# EAGLE design dmx reciever platine universal (EAGLE 6.4)
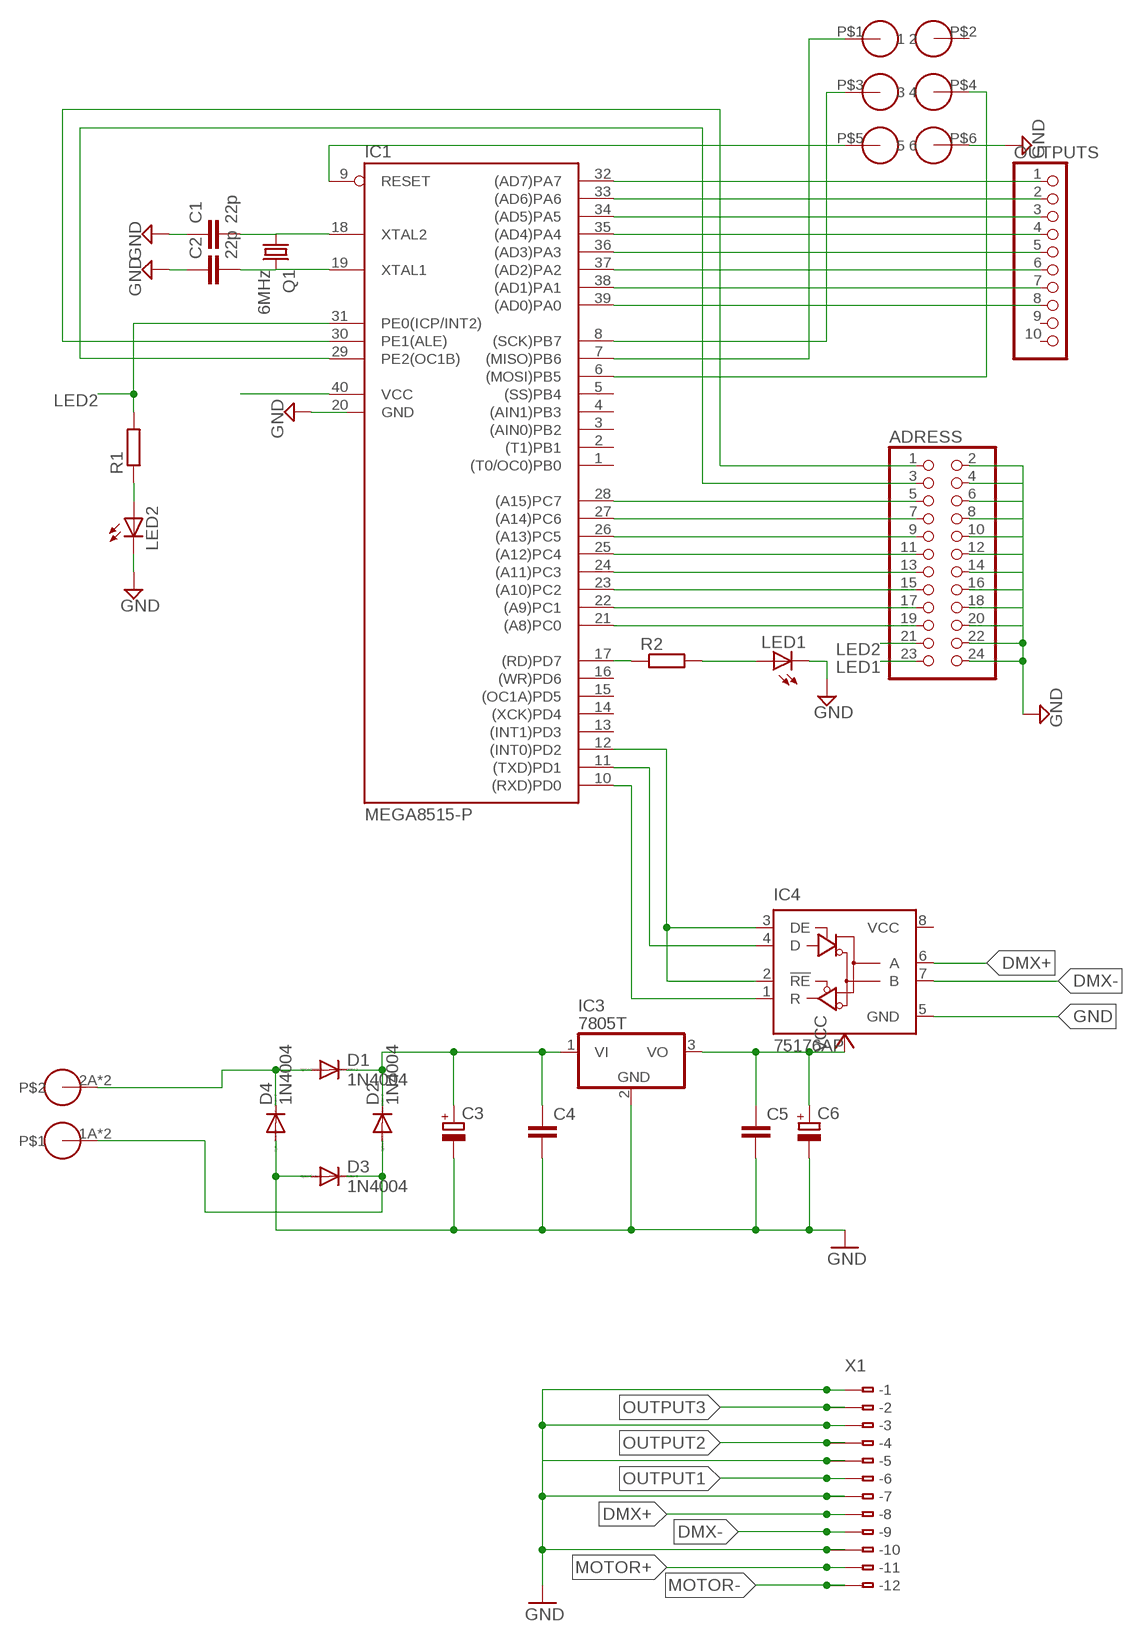
[diagram p0: schematic, sheet 1]

## Parts
ADRESS  PINHD-2X12  [2X12]
C1  22p  C-EU025-024X044  [C025-024X044]
C2  22p  C-EU025-024X044  [C025-024X044]
C3  CPOL-EUE3.5-8  [E3,5-8]
C4  C-EU025-024X044  [C025-024X044]
C5  C-EU025-024X044  [C025-024X044]
C6  CPOL-EUE3.5-8  [E3,5-8]
D1  1N4004  [DO41-10]
D2  1N4004  [DO41-10]
D3  1N4004  [DO41-10]
D4  1N4004  [DO41-10]
IC1  MEGA8515-P  [DIL40]
IC3  7805T  [TO220H]
IC4  75176AP  [DIL08]
ISP  2X3  [2X3]
LED1  LEDCHIP-LED0805  [CHIP-LED0805]
LED2  LEDCHIP-LED0805  [CHIP-LED0805]
OUTPUTS  PINHD-1X10  [1X10]
Q1  6MHz  CRYSTALHC49S  [HC49/S]
R1  R-EU_M0805  [M0805]
R2  R-EU_M0805  [M0805]
U$1  WAGO20602POL  [WAGO20602PIN]
X1  233-112  [233-112]

## Nets
DMX+: IC4.6(A) X1.A8(-8) X1.B8(B-8)
DMX-: IC4.7(B) X1.A9(-9) X1.B9(B-9)
GND: ADRESS.2 ADRESS.4 ADRESS.6 ADRESS.8 ADRESS.10 ADRESS.12 ADRESS.14 ADRESS.16 ADRESS.18 ADRESS.20 ADRESS.22 ADRESS.24 C1.1 C2.1 C3.- C4.2 C5.2 C6.- D3.A D4.A IC3.2(GND) IC4.5(GND) ISP.P$6 LED1.C LED2.C X1.A1(-1) X1.A3(-3) X1.A5(-5) X1.A7(-7) X1.A10(-10) X1.B1(B-1) X1.B3(B-3) X1.B5(B-5) X1.B7(B-7) X1.B10(B-10)
LED1: ADRESS.23 IC1.17((RD)PD7) R2.1
LED2: ADRESS.21 IC1.31(PE0(ICP/INT2)) R1.2
MOTOR+: X1.A11(-11) X1.B11(B-11)
MOTOR-: X1.A12(-12) X1.B12(B-12)
N$1: C2.2 IC1.19(XTAL1) Q1.2
N$2: C1.2 IC1.18(XTAL2) Q1.1
N$3: ADRESS.5 IC1.28((A15)PC7)
N$4: ADRESS.7 IC1.27((A14)PC6)
N$5: ADRESS.15 IC1.23((A10)PC2)
N$6: ADRESS.9 IC1.26((A13)PC5)
N$7: ADRESS.11 IC1.25((A12)PC4)
N$8: ADRESS.13 IC1.24((A11)PC3)
N$9: LED2.A R1.1
N$10: ADRESS.17 IC1.22((A9)PC1)
N$11: ADRESS.3 IC1.29(PE2(OC1B))
N$12: ADRESS.1 IC1.30(PE1(ALE))
N$16: IC1.9(RESET) ISP.P$5
N$17: IC1.8((SCK)PB7) ISP.P$3
N$18: IC1.7((MISO)PB6) ISP.P$1
N$19: IC1.6((MOSI)PB5) ISP.P$4
N$20: IC1.10((RXD)PD0) IC4.1(R)
N$21: IC1.12((INT0)PD2) IC4.2(!RE) IC4.3(DE)
N$22: IC1.11((TXD)PD1) IC4.4(D)
N$23: ADRESS.19 IC1.21((A8)PC0)
N$37: LED1.A R2.2
N$38: D1.A D4.C U$1.2A U$1.2B
N$40: D2.A D3.C U$1.1A U$1.1B
N$42: C3.+ C4.1 D1.C D2.C IC3.1(VI)
OUTPUT1: IC1.32((AD7)PA7) OUTPUTS.1 X1.A6(-6) X1.B6(B-6)
OUTPUT2: IC1.33((AD6)PA6) OUTPUTS.2 X1.A4(-4) X1.B4(B-4)
OUTPUT3: IC1.34((AD5)PA5) OUTPUTS.3 X1.A2(-2) X1.B2(B-2)
OUTPUT4: IC1.35((AD4)PA4) OUTPUTS.4
OUTPUT5: IC1.36((AD3)PA3) OUTPUTS.5
OUTPUT6: IC1.37((AD2)PA2) OUTPUTS.6
OUTPUT7: IC1.38((AD1)PA1) OUTPUTS.7
OUTPUT8: IC1.39((AD0)PA0) OUTPUTS.8
VCC: C5.1 C6.+ IC1.40(VCC) IC3.3(VO)
Unconnected: IC1.1((T0/OC0)PB0) IC1.2((T1)PB1) IC1.3((AIN0)PB2) IC1.4((AIN1)PB3) IC1.5((SS)PB4) IC1.13((INT1)PD3) IC1.14((XCK)PD4) IC1.15((OC1A)PD5) IC1.16((WR)PD6) ISP.P$2 OUTPUTS.9 OUTPUTS.10

## Power pins joined to a net without a drawn wire
GND: IC1.20(GND)
VCC: IC4.8(VCC)

## Library data of the parts
ADRESS = pinhead:PINHD-2X12: PIN HEADER
C1 C2 C4 C5 = rcl:C-EU: CAPACITOR, European symbol
C3 C6 = rcl:CPOL-EU: POLARIZED CAPACITOR, European symbol
D1-D4 = diode:1N4004: DIODE general purpose rectifier, 1 A
IC1 = atmel:MEGA8515-P: MICROCONTROLLER 8 Kbytes FLASH 512 bytes SRAM 512 bytes EEPROM USART 8-channel 10 bit ADC Source: avr.lbr; MPN: ATMEGA8515-16PU; OC_FARNELL: 9171401; OC_NEWARK: 01M6905
IC3 = linear:78*: Positive VOLTAGE REGULATOR Source: http://cache.national.com/ds/LM/LM78L05.pdf http://www.fairchildsemi.com/ds/LM/LM7805.pdf
IC4 = 751xx:75176A: DIFFERENTIAL BUS TRANSCEIVER Source: http://focus.ti.com/lit/ds/symlink/sn75176a.pdf
ISP = stiftleisten:2X3
LED1 LED2 = led:LED: LED OSRAM: - CHIPLED LG R971, LG N971, LY N971, LG Q971, LY Q971, LO R971, LY R971 LH N974, LH R974 LS Q976, LO Q976, LY Q976 LO Q996 - Hyper CHIPLED LW Q18S LB Q993, LB Q99A, LB R99A - SideLED LS A670, LO A670, LY A670, LG A670, LP A670 LB A673, LV A673, LT A673, LW A673 LH A674 LY A675 LS A676, LA A676, LO A676, LY A676, LW A676 LS A679, LY A679, LG A679 - Hyper Micro SIDELED® LS Y876, LA Y876, LO Y876, LY Y876 LT Y87S - SmartLED LW L88C, LW L88S LB L89C, LB L89S, LG L890 LS L89K, LO L89K, LY L89K LS L896, LA L896, LO L896, LY L896 - TOPLED LS T670, LO T670, LY T670, LG T670, LP T670 LSG T670, LSP T670, LSY T670, LOP T670, LYG T670 LG T671, LOG T671, LSG T671 LB T673, LV T673, LT T673, LW T673 LH T674 LS T676, LA T676, LO T676, LY T676, LB T676, LH T676, LSB T676, LW T676 LB T67C, LV T67C, LT T67C, LS T67K, LO T67K, LY T67K, LW E67C LS E67B, LA E67B, LO E67B, LY E67B, LB E67C, LV E67C, LT E67C LW T67C LS T679, LY T679, LG T679 LS T770, LO T770, LY T770, LG T770, LP T770 LB T773, LV T773, LT T773, LW T773 LH T774 LS E675, LA E675, LY E675, LS T675 LS T776, LA T776, LO T776, LY T776, LB T776 LHGB T686 LT T68C, LB T68C - Hyper Mini TOPLED® LB M676 - Mini TOPLED Santana® LG M470 LS M47K, LO M47K, LY M47K Source: http://www.osram.convergy.de LUXEON: - LUMILED® LXK2-PW12-R00, LXK2-PW12-S00, LXK2-PW14-U00, LXK2-PW14-V00 LXK2-PM12-R00, LXK2-PM12-S00, LXK2-PM14-U00 LXK2-PE12-Q00, LXK2-PE12-R00, LXK2-PE12-S00, LXK2-PE14-T00, LXK2-PE14-U00 LXK2-PB12-K00, LXK2-PB12-L00, LXK2-PB12-M00, LXK2-PB14-N00, LXK2-PB14-P00, LXK2-PB14-Q00 LXK2-PR12-L00, LXK2-PR12-M00, LXK2-PR14-Q00, LXK2-PR14-R00 LXK2-PD12-Q00, LXK2-PD12-R00, LXK2-PD12-S00 LXK2-PH12-R00, LXK2-PH12-S00 LXK2-PL12-P00, LXK2-PL12-Q00, LXK2-PL12-R00 Source: www.luxeon.com KINGBRIGHT: KA-3528ASYC Source: www.kingbright.com
OUTPUTS = pinhead:PINHD-1X10: PIN HEADER
Q1 = crystal:CRYSTAL: CRYSTAL; OC_FARNELL: 1667008; OC_NEWARK: unknown
R1 R2 = rcl:R-EU_: RESISTOR, European symbol
U$1 = blafoo:WAGO20602POL
X1 = con-wago:233-112: WAGO Cage Clamp; MPN: 233-112; OC_FARNELL: unknown; OC_NEWARK: 28K9053

## Board
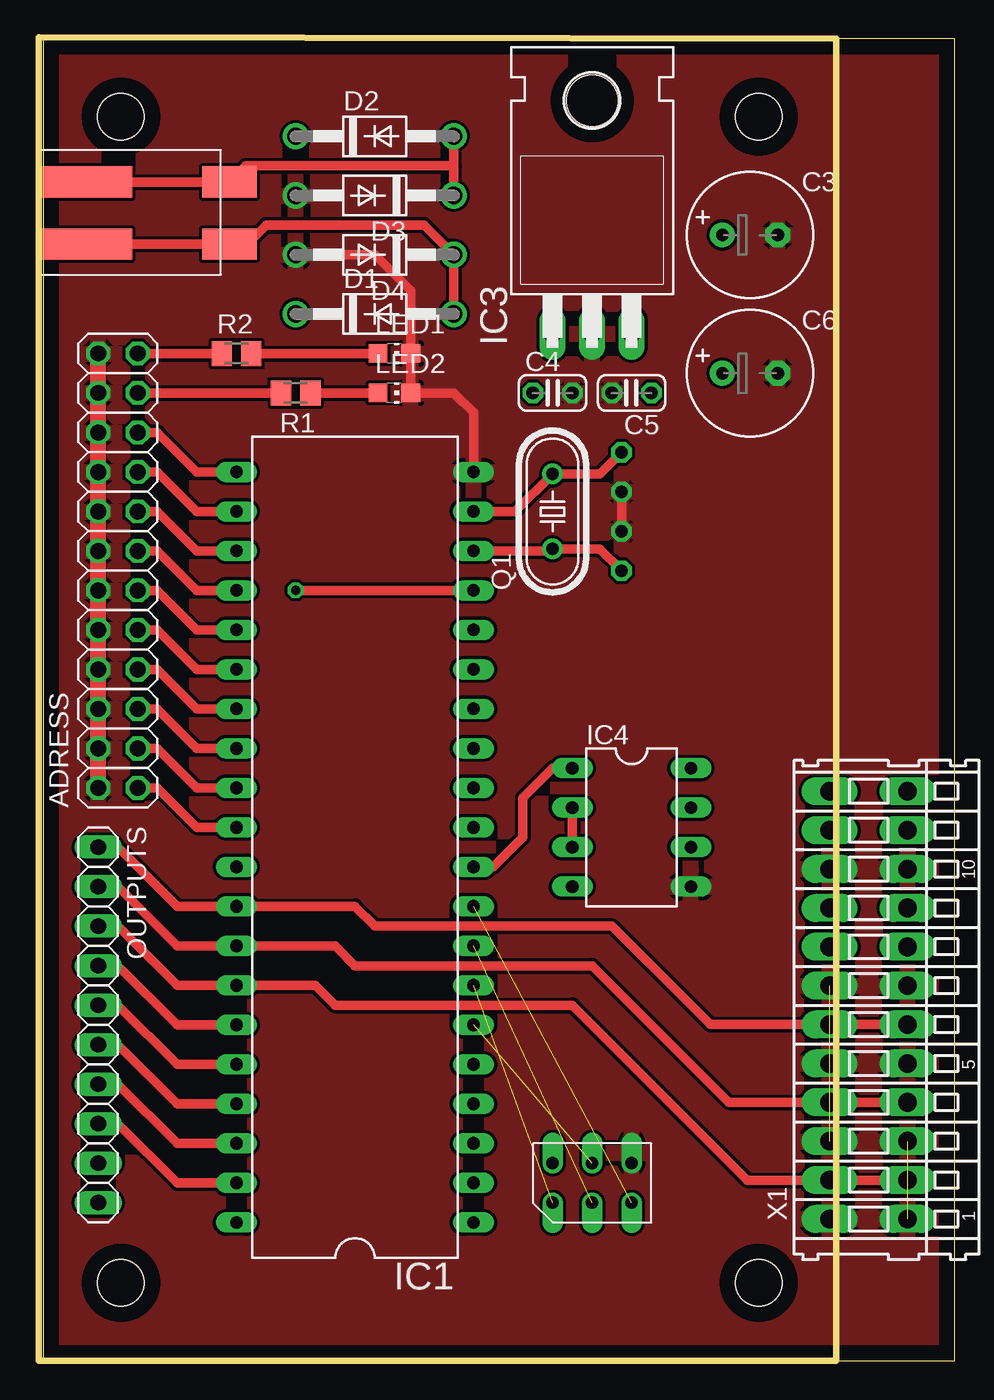
[diagram p1: board, top side]
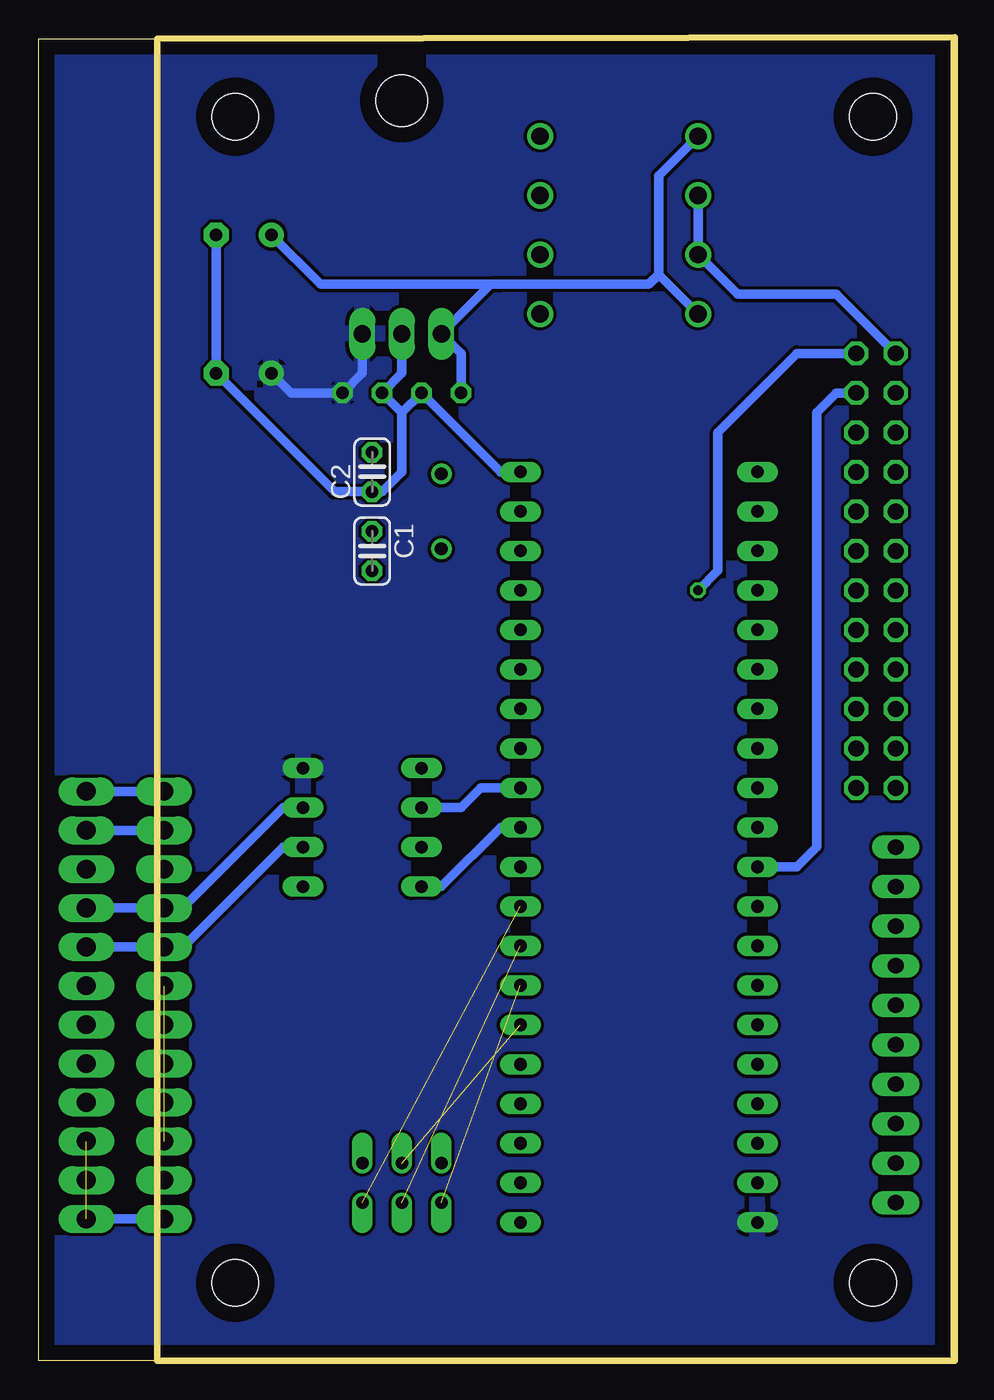
[diagram p2: board, bottom side, seen from below]

Size 58.62 x 85 mm. Coordinates in mm from the lower left corner, seen from the top.
Outline: 0,0 58.62,0 58.62,85 0,85 0,0
Copper layers (1*16): Top 0.035mm / dielectric 1.5mm / Bottom 0.035mm
Design rules "default": minimum track width 10mil, minimum drill 24mil, track to track 8mil, track to pad 8mil, pad to pad 8mil, via to via 8mil, smd to smd 8mil, copper to edge 40mil, drill to drill 8mil, minimum pad ring 10mil, minimum via ring 8mil, stop-mask expansion 4mil, vias tented up to drill 0mil, thermal gap 10mil
Holes 3 mm at 5,80 46,80 46,5 5,5
Milling: 4 lines

### Footprints (pad centres in the part's own frame; a part is rotated, then mirrored left to right if it is on the bottom)
2X12 = drill 1.016 octagon: 1 -13.97,-1.27; 2 -13.97,1.27; 3 -11.43,-1.27; 4 -11.43,1.27; 5 -8.89,-1.27; 6 -8.89,1.27; 7 -6.35,-1.27; 8 -6.35,1.27; 9 -3.81,-1.27; 10 -3.81,1.27; 11 -1.27,-1.27; 12 -1.27,1.27; 13 1.27,-1.27; 14 1.27,1.27; 15 3.81,-1.27; 16 3.81,1.27; 17 6.35,-1.27; 18 6.35,1.27; 19 8.89,-1.27; 20 8.89,1.27; 21 11.43,-1.27; 22 11.43,1.27; 23 13.97,-1.27; 24 13.97,1.27
C025-024X044 = drill 0.813 octagon: 1 -1.27,0; 2 1.27,0
E3,5-8 = drill 0.813 pad 1.6: + -1.778,0 | drill 0.813 pad 1.6 octagon: - 1.778,0
DO41-10 = drill 1.118: A 5.08,0; C -5.08,0
DIL40 = drill 0.813 long: 1 -24.13,-7.62; 2 -21.59,-7.62; 3 -19.05,-7.62; 4 -16.51,-7.62; 5 -13.97,-7.62; 6 -11.43,-7.62; 7 -8.89,-7.62; 8 -6.35,-7.62; 9 -3.81,-7.62; 10 -1.27,-7.62; 11 1.27,-7.62; 12 3.81,-7.62; 13 6.35,-7.62; 14 8.89,-7.62; 15 11.43,-7.62; 16 13.97,-7.62; 17 16.51,-7.62; 18 19.05,-7.62; 19 21.59,-7.62; 20 24.13,-7.62; 21 24.13,7.62; 22 21.59,7.62; 23 19.05,7.62; 24 16.51,7.62; 25 13.97,7.62; 26 11.43,7.62; 27 8.89,7.62; 28 6.35,7.62; 29 3.81,7.62; 30 1.27,7.62; 31 -1.27,7.62; 32 -3.81,7.62; 33 -6.35,7.62; 34 -8.89,7.62; 35 -11.43,7.62; 36 -13.97,7.62; 37 -16.51,7.62; 38 -19.05,7.62; 39 -21.59,7.62; 40 -24.13,7.62
TO220H = drill 1.118 long: 1 -2.54,-10.16; 2 0,-10.16; 3 2.54,-10.16 | hole 3.302: 0,4.826
DIL08 = drill 0.813 long: 1 -3.81,-3.81; 2 -1.27,-3.81; 3 1.27,-3.81; 4 3.81,-3.81; 5 3.81,3.81; 6 1.27,3.81; 7 -1.27,3.81; 8 -3.81,3.81
2X3 = drill 0.8 offset: P$1 -1.27,2.54; P$2 1.27,2.54; P$3 -1.27,0; P$4 1.27,0; P$5 -1.27,-2.54; P$6 1.27,-2.54
CHIP-LED0805 = smd 1.2 x 1.2: A 0,-1.05; C 0,1.05
1X10 = drill 1.016 long: 1 -11.43,0; 2 -8.89,0; 3 -6.35,0; 4 -3.81,0; 5 -1.27,0; 6 1.27,0; 7 3.81,0; 8 6.35,0; 9 8.89,0; 10 11.43,0
HC49/S = drill 0.813: 1 -2.413,0; 2 2.413,0
M0805 = smd 1.3 x 1.6: 1 -0.95,0; 2 0.95,0
WAGO20602PIN = smd 6 x 2: 1A -2.08,2.14; 2A -2.08,-1.86 | smd 3.5 x 2: 1B 7.17,2.14; 2B 7.17,-1.86
233-112 = drill 1.2 long: A1 -13.75,2.5; A2 -11.25,2.5; A3 -8.75,2.5; A4 -6.25,2.5; A5 -3.75,2.5; A6 -1.25,2.5; A7 1.25,2.5; A8 3.75,2.5; A9 6.25,2.5; A10 8.75,2.5; A11 11.25,2.5; A12 13.75,2.5; B1 -13.75,-2.5; B2 -11.25,-2.5; B3 -8.75,-2.5; B4 -6.25,-2.5; B5 -3.75,-2.5; B6 -1.25,-2.5; B7 1.25,-2.5; B8 3.75,-2.5; B9 6.25,-2.5; B10 8.75,-2.5; B11 11.25,-2.5; B12 13.75,-2.5

### Placement (x,y rotation side)
ADRESS  4.81,50.8 90 top
C1  37.2,52.07 270 bottom
C2  37.2,57.15 90 bottom
C3  45.45,72.39 0 top
C4  32.75,62.23 0 top
C5  37.83,62.23 180 top
C6  45.45,63.5 0 top
D1  21.32,67.31 0 top
D2  21.32,78.74 0 top
D3  21.32,74.93 180 top
D4  21.32,71.12 180 top
IC1  20.05,33.02 90 top
IC3  35.29,76.2 0 top
IC4  37.83,34.29 270 top
ISP  35.29,11.43 90 top
LED1  22.59,64.77 270 top
LED2  22.59,62.23 270 top
OUTPUTS  3.54,21.59 270 top
Q1  32.75,54.61 90 top
R1  16.24,62.23 180 top
R2  12.43,64.77 0 top
U$1  4.81,73.66 0 top
X1  53.07,22.86 90 top

### Tracks (layer width: path | path; a pad name or v marks a point on that pad's centre or on a via)
DMX+
  Bottom 0.61: X1.B8 X1.A8 50.57,26.63 50.53,26.67 49.26,26.67 42.91,33.02 IC4.6
DMX-
  Bottom 0.61: X1.B9 X1.A9 49.36,29.11 42.91,35.56 IC4.7
GND  (3 unrouted)
  Top 0.61: C2.1 C1.1 | D4.A 21.32,71.12 23.64,68.8 LED1.C LED2.C 26.4,62.23 27.67,60.96 IC1.20
  Top 1.016: ADRESS.2 ADRESS.4 ADRESS.6 ADRESS.8 ADRESS.10 ADRESS.12 ADRESS.14 ADRESS.16 ADRESS.18 ADRESS.20 ADRESS.22 ADRESS.24
  Bottom 0.61: D3.A D4.A 13.7,68.58 7.35,68.58 ADRESS.24 | 35.29,60.96 35.29,57.15 36.56,55.88 C2.1 39.61,55.88 C6.- C3.- | 35.29,60.96 C4.2 28.94,57.15 IC1.20 | 35.29,60.96 C5.2 35.29,63.5 IC3.2 | X1.A1 X1.B1
  pour Top: -0.27,85.09 58.62,85 58.62,0 -0.27,0
LED1  (via drill 0.6)
  Top 0.61: ADRESS.23 R2.1 | IC1.17 v16.24,49.53
  Bottom 0.61: v16.24,49.53 14.97,50.8 14.97,59.69 9.89,64.77 ADRESS.23
LED2
  Top 0.61: ADRESS.21 R1.2
  Bottom 0.61: IC1.31 9.89,31.75 8.62,33.02 8.62,60.96 7.35,62.23 ADRESS.21
MOTOR+
  Bottom 0.61: X1.B11 X1.A11
MOTOR-
  Bottom 0.61: X1.A12 X1.B12
N$1
  Top 0.61: IC1.19 30.34,54.61 Q1.2 35.8,57.02 C2.2
N$2
  Top 0.61: IC1.18 32.62,52.07 Q1.1 35.8,52.2 C1.2
N$3
  Top 0.61: ADRESS.5 7.35,41.91 9.89,39.37 IC1.28
N$4
  Top 0.61: ADRESS.7 7.35,44.45 9.89,41.91 IC1.27
N$5
  Top 0.61: ADRESS.15 7.35,54.61 9.89,52.07 IC1.23
N$6
  Top 0.61: ADRESS.9 7.35,46.99 9.89,44.45 IC1.26
N$7
  Top 0.61: ADRESS.11 7.35,49.53 9.89,46.99 IC1.25
N$8
  Top 0.61: ADRESS.13 7.35,52.07 9.89,49.53 IC1.24
N$9
  Top 0.61: R1.1 LED2.A
N$10
  Top 0.61: ADRESS.17 7.35,57.15 9.89,54.61 IC1.22
N$11
  Top 0.61: ADRESS.3 7.35,39.37 9.89,36.83 IC1.29
N$12
  Top 0.61: ADRESS.1 7.35,36.83 9.89,34.29 IC1.30
N$16  (1 unrouted)
N$17  (1 unrouted)
N$18  (1 unrouted)
N$19  (1 unrouted)
N$20
  Top 0.61: IC4.1 32.75,38.1 30.84,36.2 30.84,33.66 28.94,31.75 IC1.10
N$21
  Top 0.61: IC4.2 IC4.3
  Bottom 0.61: IC1.12 30.21,36.83 31.48,35.56 IC4.2
N$22
  Bottom 0.61: IC1.11 28.94,34.29 32.75,30.48 IC4.4
N$23
  Top 0.61: IC1.21 9.89,57.15 7.35,59.69 ADRESS.19
N$37
  Top 0.61: R2.2 LED1.A
N$38
  Top 0.61: U$1.2A U$1.2B 13.11,71.8 14.34,73.03 24.5,73.03 D4.C D1.A
N$40
  Top 0.61: U$1.1A U$1.1B 13.02,76.83 26.4,76.83 | 26.4,76.83 D2.A | D3.C 26.4,76.83
N$42
  Bottom 0.61: D2.C 18.78,76.2 18.78,69.85 | 18.78,69.85 D1.C | 18.78,69.85 19.41,69.22 28.94,69.22 29.57,69.22 | 29.57,69.22 IC3.1 31.48,64.77 C4.1 | C3.+ 40.5,69.22 29.57,69.22
OUTPUT1
  Top 0.61: OUTPUTS.1 4.81,33.02 8.62,29.21 IC1.32 20.05,29.21 21.32,27.94 36.56,27.94 42.89,21.61 X1.A6 X1.B6
OUTPUT2
  Top 0.61: OUTPUTS.2 4.81,30.48 8.62,26.67 IC1.33 18.78,26.67 20.05,25.4 35.29,25.4 44.08,16.61 X1.A4 X1.B4
OUTPUT3
  Top 0.61: OUTPUTS.3 4.81,27.94 8.62,24.13 IC1.34 17.51,24.13 18.78,22.86 34.02,22.86 45.27,11.61 X1.A2 X1.B2
OUTPUT4
  Top 0.61: OUTPUTS.4 4.81,25.4 8.62,21.59 IC1.35
OUTPUT5
  Top 0.61: OUTPUTS.5 4.81,22.86 8.62,19.05 IC1.36
OUTPUT6
  Top 0.61: OUTPUTS.6 4.81,20.32 8.62,16.51 IC1.37
OUTPUT7
  Top 0.61: OUTPUTS.7 4.81,17.78 8.62,13.97 IC1.38
OUTPUT8
  Top 0.61: OUTPUTS.8 4.81,15.24 8.62,11.43 IC1.39
VCC
  Bottom 0.61: IC3.3 37.83,63.5 C5.1 42.4,62.23 C6.+
  pour Bottom: -0.27,0 58.62,0 58.62,85 -0.27,85.09